# EAGLE design power mux-v2 (EAGLE 6.5.0)
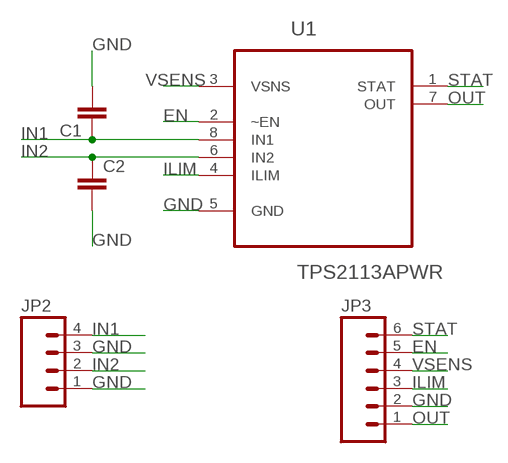
[diagram p0: schematic, sheet 1]

## Parts
C1  CAP0805  [0805]
C2  CAP0805  [0805]
JP2  M04PTH  [1X04]
JP3  M06SIP  [1X06]
U1  TPS2113APWR  [SOP65P640X120-8N]

## Nets
EN: JP3.5 U1.2(~EN)
GND: C1.2 C2.2 JP2.1 JP2.3 JP3.2 U1.5(GND)
ILIM: JP3.3 U1.4(ILIM)
IN1: C1.1 JP2.4 U1.8(IN1)
IN2: C2.1 JP2.2 U1.6(IN2)
OUT: JP3.1 U1.7(OUT)
STAT: JP3.6 U1.1(STAT)
VSENS: JP3.4 U1.3(VSNS)

## Library data of the parts
C1 C2 = SparkFun-Capacitors:CAP: Capacitor Standard 0603 ceramic capacitor, and 0.1" leaded capacitor.
JP2 = SparkFun-Connectors:M04: Header 4 Standard 4-pin 0.1" header. Use with straight break away headers (SKU : PRT-00116), right angle break away headers (PRT-00553), swiss pins (PRT-00743), machine pins (PRT-00117), and female headers (PRT-00115). Molex polarized connector foot print use with SKU : PRT-08231 with associated crimp pins and housings. 1MM SMD Version SKU: PRT-10208
JP3 = SparkFun-Connectors:M06: Header 6 Standard 6-pin 0.1" header. Use with straight break away headers (SKU : PRT-00116), right angle break away headers (PRT-00553), swiss pins (PRT-00743), machine pins (PRT-00117), and female headers (PRT-00115). Molex polarized connector foot print use with SKU : PRT-08094 with associated crimp pins and housings. NOTES ON THE VARIANTS LOCK and LOCK_LONGPADS... This footprint was designed to help hold the alignment of a through-hole component (i.e. 6-pin header) while soldering it into place. You may notice that each hole has been shifted either up or down by 0.005 of an inch from it's more standard position (which is a perfectly straight line). This slight alteration caused the pins (the squares in the middle) to touch the edges of the holes. Because they are alternating, it causes a "brace" to hold the component in place. 0.005 has proven to be the perfect amount of "off-center" position when using our standard breakaway headers. Although looks a little odd when you look at the bare footprint, once you have a header in there, the alteration is very hard to notice. Also,if you push a header all the way into place, it is covered up entirely on the bottom side. This idea of altering the position of holes to aid alignment will be further integrated into the Sparkfun Library for other footprints. It can help hold any component with 3 or more connection pins.
U1 = Texas Instruments_By_element14_Batch_1:TPS2113APWR: AUTOSWITCHING POWER MUX; MPN: TPS2113APWR; OC_FARNELL: 1757288; OC_NEWARK: 01J0961; PACKAGE: TSSOP-8; SUPPLIER: TEXAS INSTRUMENTS

## Board
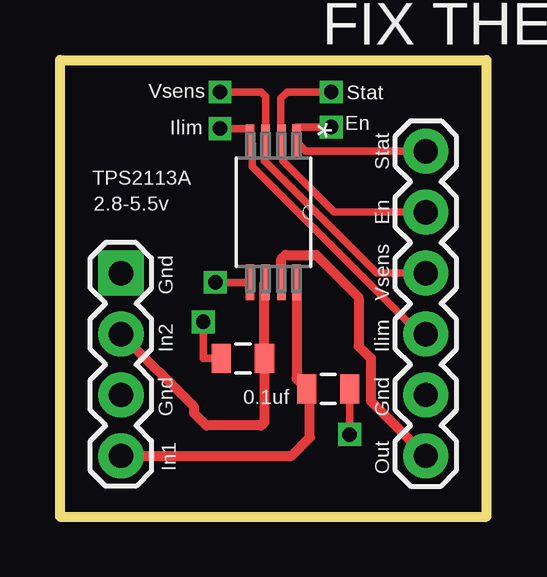
[diagram p1: board, top side]
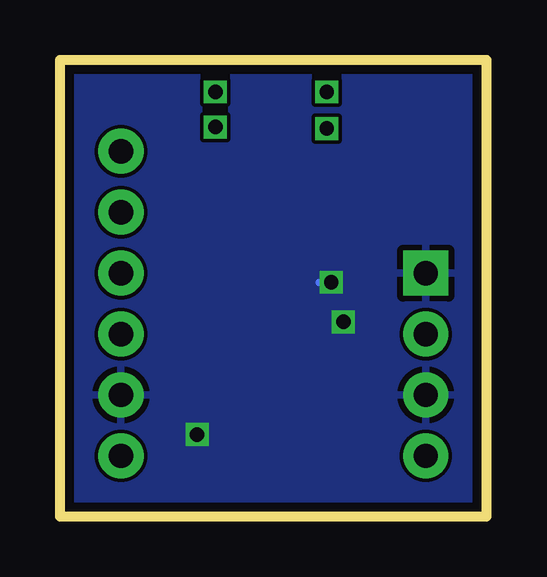
[diagram p2: board, bottom side, seen from below]

Size 17.78 x 19.05 mm. Coordinates in mm from the lower left corner, seen from the top.
Outline: 0,0 0,19.05 17.78,19.05 17.78,0 0,0
Copper layers (1*16): Top 0.0356mm / dielectric 1.5011mm / Bottom 0.0356mm
Design rules "LaenPCBOrder": minimum track width 6mil, minimum drill 13mil, track to track 6mil, track to pad 6mil, pad to pad 6mil, via to via 6mil, smd to smd 6mil, copper to edge 15mil, drill to drill 6mil, minimum pad ring 7mil, minimum via ring 7mil, stop-mask expansion 3mil, vias tented up to drill 0mil, thermal gap 10mil

### Footprints (pad centres in the part's own frame; a part is rotated, then mirrored left to right if it is on the bottom)
0805 = smd 0.8 x 1.2: 1 -0.9,0; 2 0.9,0
1X04 = drill 1.016 pad 1.88 square: 1 0,0 | drill 1.016 pad 1.88: 2 2.54,0; 3 5.08,0; 4 7.62,0
1X06 = drill 1.016 pad 1.88: 1 0,0; 2 2.54,0; 3 5.08,0; 4 7.62,0; 5 10.16,0; 6 12.7,0
SOP65P640X120-8N = smd 1.473 x 0.356: 1 -2.921,0.965; 2 -2.921,0.33; 3 -2.921,-0.33; 4 -2.921,-0.965; 5 2.921,-0.965; 6 2.921,-0.33; 7 2.921,0.33; 8 2.921,0.965

### Placement (x,y rotation side)
C1  11.18,5.33 0 top
C2  7.62,6.6 180 top
JP2  2.54,10.16 270 top
JP3  15.24,2.54 90 top
U1  8.89,12.7 270 top

### Tracks (layer width: path | path; a pad name or v marks a point on that pad's centre or on a via)
EN
  Top 0.305: JP3.5 11.43,12.7 9.27,14.86 9.27,15.57 U1.2
GND  (via drill 0.6)
  Top 0.305: U1.5 v6.48,9.78 | C2.2 5.97,6.6 v5.97,8.13 | C1.2 12.08,3.44 v12.06,3.43
  Bottom 0.305: v6.48,9.78 6.99,9.78
  pour Bottom: 0,19.05 0,0 17.78,0 17.78,19.05
ILIM
  Top 0.305: JP3.3 14.99,7.62 8,14.61 8,15.54 U1.4
IN1
  Top 0.406: JP2.4 9.65,2.54 10.41,3.3 10.41,4.96 C1.1 9.86,5.75 U1.8
IN2
  Top 0.406: U1.6 8.52,9.74 C2.1 8.52,3.95 8.38,3.81 6.1,3.81 5.59,4.32 5.59,4.57 JP2.2
N$1  (via drill 0.6)
  Top 0.305: 7.94,16.19 v6.67,16.19
N$2  (via drill 0.6)
  Top 0.305: 8.57,16.13 8.57,17.53 8.38,17.72 v6.67,17.72
N$3  (via drill 0.6)
  Top 0.305: 9.21,16.19 9.21,17.46 9.46,17.72 v11.3,17.72
N$4  (via drill 0.6)
  Top 0.305: 9.84,16.26 v11.3,16.26
OUT
  Top 0.406: U1.7 9.22,10.74 9.4,10.92 10.67,10.92 12.45,9.14 12.45,7.11 12.95,6.6 12.95,4.83 JP3.1
STAT
  Top 0.305: JP3.6 10.24,15.24 U1.1
VSENS
  Top 0.305: JP3.4 13.21,10.16 8.51,14.86 8.51,15.57 U1.3

### Text on the board
tPlace: FIX THE SILK!!!!!!!!!!!1111 | Vsens | Stat | Ilim | En | TPS2113A | Stat | 2.8-5.5v | En | Gnd | Vsens | In2 | Ilim | 0.1uf | Gnd | Gnd | In1 | Out